# Altium schematic sheet Sheet1.SchDoc
size 359 x 279 mm; SheetNumber: 1; SheetTotal: 1
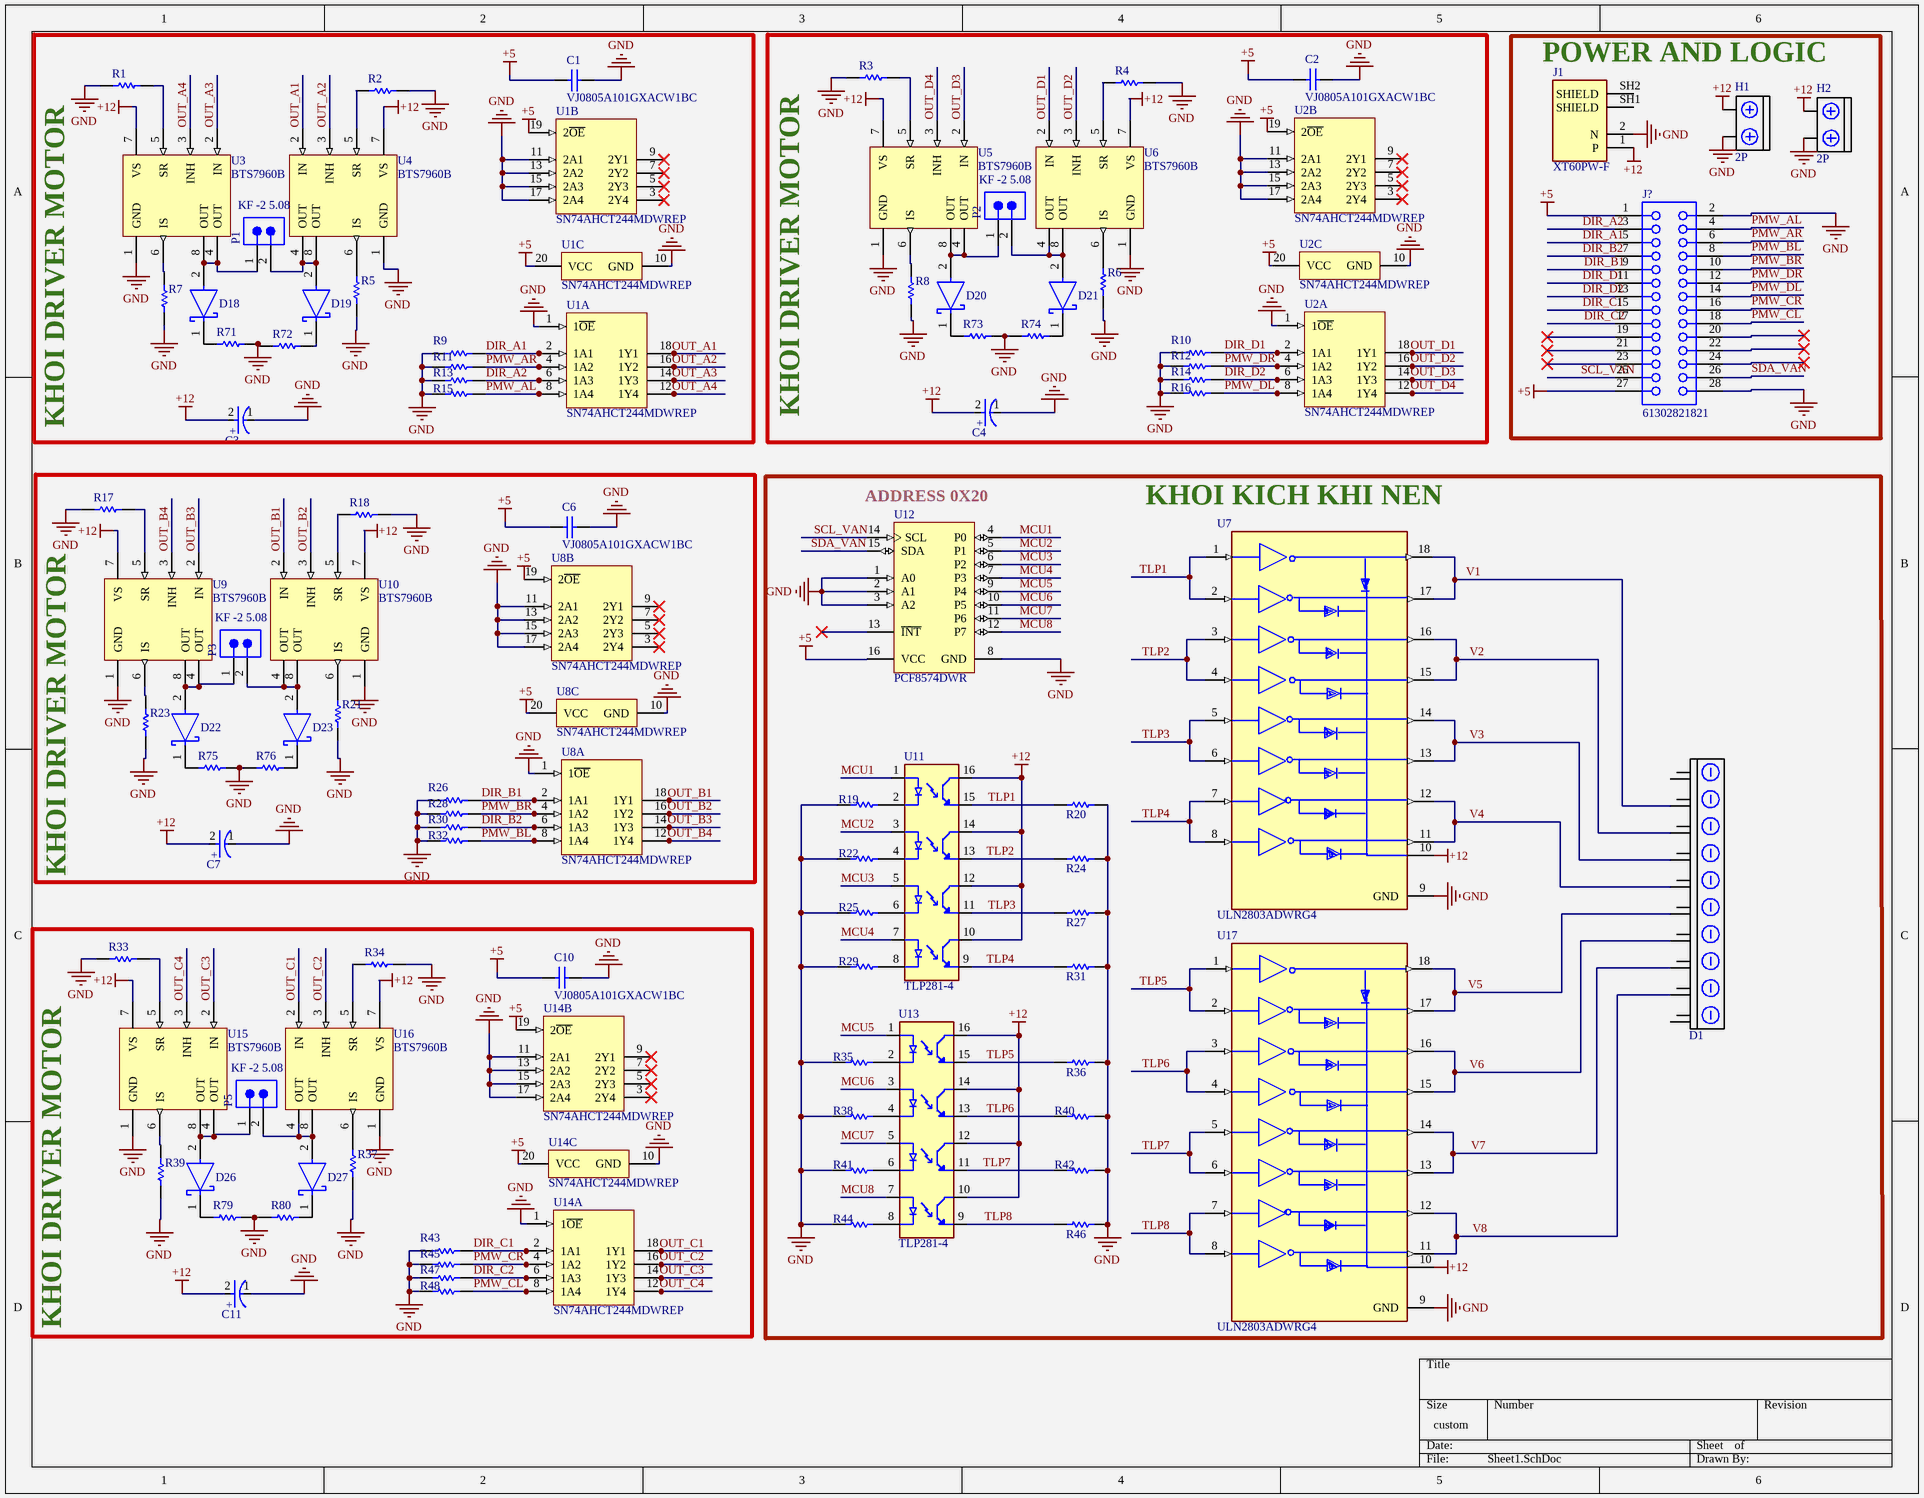
[diagram p0: Sheet1.SchDoc]

## Parts
C1  VJ0805A101GXACW1BC  [CAPC2013X145X50NL20T20]
C2  VJ0805A101GXACW1BC  [CAPC2013X145X50NL20T20]
C3  EEUFM1H151B  [FP-RAD-TH-D_10_0_5-L_12_5-MFG]  (value not drawn)
C4  EEUFM1H151B  [FP-RAD-TH-D_10_0_5-L_12_5-MFG]  (value not drawn)
C6  VJ0805A101GXACW1BC  [CAPC2013X145X50NL20T20]
C7  EEUFM1H151B  [FP-RAD-TH-D_10_0_5-L_12_5-MFG]  (value not drawn)
C10  VJ0805A101GXACW1BC  [CAPC2013X145X50NL20T20]
C11  EEUFM1H151B  [FP-RAD-TH-D_10_0_5-L_12_5-MFG]  (value not drawn)
D1  10P  [KF141_10P]  (value not drawn)
D18  1N5819HW-7-F  [FP-SOD123-IPC_A]  (value not drawn)
D19  1N5819HW-7-F  [FP-SOD123-IPC_A]  (value not drawn)
D20  1N5819HW-7-F  [FP-SOD123-IPC_A]  (value not drawn)
D21  1N5819HW-7-F  [FP-SOD123-IPC_A]  (value not drawn)
D22  1N5819HW-7-F  [FP-SOD123-IPC_A]  (value not drawn)
D23  1N5819HW-7-F  [FP-SOD123-IPC_A]  (value not drawn)
D26  1N5819HW-7-F  [FP-SOD123-IPC_A]  (value not drawn)
D27  1N5819HW-7-F  [FP-SOD123-IPC_A]  (value not drawn)
H1  2P  [KF128-2P]
H2  2P  [KF128-2P]
J1  XT60PW-F  [AMASS_XT60PW-F]
J?  61302821821  [61302821821]
P1  KF -2 5.08  [691312510002]
P2  KF -2 5.08  [691312510002]
P3  KF -2 5.08  [691312510002]
P5  KF -2 5.08  [691312510002]
R1  CRCW08051K00FKTC  [RESC2013X50X30ML20T20]  (value not drawn)
R2  CRCW08051K00FKTC  [RESC2013X50X30ML20T20]  (value not drawn)
R3  CRCW08051K00FKTC  [RESC2013X50X30ML20T20]  (value not drawn)
R4  CRCW08051K00FKTC  [RESC2013X50X30ML20T20]  (value not drawn)
R5  CRCW08051K00FKTC  [RESC2013X50X30ML20T20]  (value not drawn)
R6  CRCW08051K00FKTC  [RESC2013X50X30ML20T20]  (value not drawn)
R7  CRCW08051K00FKTC  [RESC2013X50X30ML20T20]  (value not drawn)
R8  CRCW08051K00FKTC  [RESC2013X50X30ML20T20]  (value not drawn)
R9  CRCW08051K00FKTC  [RESC2013X50X30ML20T20]  (value not drawn)
R10  CRCW08051K00FKTC  [RESC2013X50X30ML20T20]  (value not drawn)
R11  CRCW08051K00FKTC  [RESC2013X50X30ML20T20]  (value not drawn)
R12  CRCW08051K00FKTC  [RESC2013X50X30ML20T20]  (value not drawn)
R13  CRCW08051K00FKTC  [RESC2013X50X30ML20T20]  (value not drawn)
R14  CRCW08051K00FKTC  [RESC2013X50X30ML20T20]  (value not drawn)
R15  CRCW08051K00FKTC  [RESC2013X50X30ML20T20]  (value not drawn)
R16  CRCW08051K00FKTC  [RESC2013X50X30ML20T20]  (value not drawn)
R17  CRCW08051K00FKTC  [RESC2013X50X30ML20T20]  (value not drawn)
R18  CRCW08051K00FKTC  [RESC2013X50X30ML20T20]  (value not drawn)
R19  CRCW08051K00FKTC  [RESC2013X50X30ML20T20]  (value not drawn)
R20  CRCW08051K00FKTC  [RESC2013X50X30ML20T20]  (value not drawn)
R21  CRCW08051K00FKTC  [RESC2013X50X30ML20T20]  (value not drawn)
R22  CRCW08051K00FKTC  [RESC2013X50X30ML20T20]  (value not drawn)
R23  CRCW08051K00FKTC  [RESC2013X50X30ML20T20]  (value not drawn)
R24  CRCW08051K00FKTC  [RESC2013X50X30ML20T20]  (value not drawn)
R25  CRCW08051K00FKTC  [RESC2013X50X30ML20T20]  (value not drawn)
R26  CRCW08051K00FKTC  [RESC2013X50X30ML20T20]  (value not drawn)
R27  CRCW08051K00FKTC  [RESC2013X50X30ML20T20]  (value not drawn)
R28  CRCW08051K00FKTC  [RESC2013X50X30ML20T20]  (value not drawn)
R29  CRCW08051K00FKTC  [RESC2013X50X30ML20T20]  (value not drawn)
R30  CRCW08051K00FKTC  [RESC2013X50X30ML20T20]  (value not drawn)
R31  CRCW08051K00FKTC  [RESC2013X50X30ML20T20]  (value not drawn)
R32  CRCW08051K00FKTC  [RESC2013X50X30ML20T20]  (value not drawn)
R33  CRCW08051K00FKTC  [RESC2013X50X30ML20T20]  (value not drawn)
R34  CRCW08051K00FKTC  [RESC2013X50X30ML20T20]  (value not drawn)
R35  CRCW08051K00FKTC  [RESC2013X50X30ML20T20]  (value not drawn)
R36  CRCW08051K00FKTC  [RESC2013X50X30ML20T20]  (value not drawn)
R37  CRCW08051K00FKTC  [RESC2013X50X30ML20T20]  (value not drawn)
R38  CRCW08051K00FKTC  [RESC2013X50X30ML20T20]  (value not drawn)
R39  CRCW08051K00FKTC  [RESC2013X50X30ML20T20]  (value not drawn)
R40  CRCW08051K00FKTC  [RESC2013X50X30ML20T20]  (value not drawn)
R41  CRCW08051K00FKTC  [RESC2013X50X30ML20T20]  (value not drawn)
R42  CRCW08051K00FKTC  [RESC2013X50X30ML20T20]  (value not drawn)
R43  CRCW08051K00FKTC  [RESC2013X50X30ML20T20]  (value not drawn)
R44  CRCW08051K00FKTC  [RESC2013X50X30ML20T20]  (value not drawn)
R45  CRCW08051K00FKTC  [RESC2013X50X30ML20T20]  (value not drawn)
R46  CRCW08051K00FKTC  [RESC2013X50X30ML20T20]  (value not drawn)
R47  CRCW08051K00FKTC  [RESC2013X50X30ML20T20]  (value not drawn)
R48  CRCW08051K00FKTC  [RESC2013X50X30ML20T20]  (value not drawn)
R71  CRCW08051K00FKTC  [RESC2013X50X30ML20T20]  (value not drawn)
R72  CRCW08051K00FKTC  [RESC2013X50X30ML20T20]  (value not drawn)
R73  CRCW08051K00FKTC  [RESC2013X50X30ML20T20]  (value not drawn)
R74  CRCW08051K00FKTC  [RESC2013X50X30ML20T20]  (value not drawn)
R75  CRCW08051K00FKTC  [RESC2013X50X30ML20T20]  (value not drawn)
R76  CRCW08051K00FKTC  [RESC2013X50X30ML20T20]  (value not drawn)
R79  CRCW08051K00FKTC  [RESC2013X50X30ML20T20]  (value not drawn)
R80  CRCW08051K00FKTC  [RESC2013X50X30ML20T20]  (value not drawn)
U1  SN74AHCT244MDWREP  [DW0020A_N]  (parts A,B,C of 3)
U2  SN74AHCT244MDWREP  [DW0020A_N]  (parts A,B,C of 3)
U3  BTS7960B  [INF-P-TO-263-7-6_M]
U4  BTS7960B  [INF-P-TO-263-7-6_M]
U5  BTS7960B  [INF-P-TO-263-7-6_M]
U6  BTS7960B  [INF-P-TO-263-7-6_M]
U7  ULN2803ADWRG4  [FP-DW0018A-MFG]
U8  SN74AHCT244MDWREP  [DW0020A_N]  (parts A,B,C of 3)
U9  BTS7960B  [INF-P-TO-263-7-6_M]
U10  BTS7960B  [INF-P-TO-263-7-6_M]
U11  TLP281-4  [SOIC127P700X210-16N]
U12  PCF8574DWR  [DW0016A_L]
U13  TLP281-4  [SOIC127P700X210-16N]
U14  SN74AHCT244MDWREP  [DW0020A_N]  (parts A,B,C of 3)
U15  BTS7960B  [INF-P-TO-263-7-6_M]
U16  BTS7960B  [INF-P-TO-263-7-6_M]
U17  ULN2803ADWRG4  [FP-DW0018A-MFG]

## Blocks framed on the sheet
KHOI DRIVER MOTOR: C1 C3 D18 D19 P1 R1 R2 R5 R7 R9 R11 R13 R15 R71 R72 U1 U3 U4
KHOI DRIVER MOTOR: C2 C4 D20 D21 P2 R3 R4 R6 R8 R10 R12 R14 R16 R73 R74 U2 U5 U6
POWER AND LOGIC: H1 H2 J1 J?
KHOI DRIVER MOTOR: C6 C7 D22 D23 P3 R17 R18 R21 R23 R26 R28 R30 R32 R75 R76 U8-U10
KHOI KICH KHI NEN: D1 R19 R20 R22 R24 R25 R27 R29 R31 R35 R36 R38 R40-R42 R44 R46 U7 U11-U13 U17
KHOI DRIVER MOTOR: C10 C11 D26 D27 P5 R33 R34 R37 R39 R43 R45 R47 R48 R79 R80 U14-U16

## Nets
+5: C1.1 C2.1 C6.1 C10.1 J?.1 J?.27 U1.19(2~{OE}) U1.20(VCC) U2.19(2~{OE}) U2.20(VCC) U8.19(2~{OE}) U8.20(VCC) U12.16(VCC) U14.19(2~{OE}) U14.20(VCC)
+12: C3.2(A) C4.2(A) C7.2(A) C11.2(A) H1.1 H2.1 J1.1(P) U3.7(VS) U4.7(VS) U5.7(VS) U6.7(VS) U7.10(COM) U9.7(VS) U10.7(VS) U11.10(CT4) U11.12(CT3) U11.14(CT2) U11.16(CT1) U13.10(CT4) U13.12(CT3) U13.14(CT2) U13.16(CT1) U15.7(VS) U16.7(VS) U17.10(COM)
GND: C1.2 C2.2 C3.1(C) C4.1(C) C6.2 C7.1(C) C10.2 C11.1(C) H1.2 H2.2 J1.2(N) J?.2 J?.28 R1.2 R2.2 R3.2 R4.2 R5.1 R6.1 R7.1 R8.1 R9.1 R10.1 R11.1 R12.1 R13.1 R14.1 R15.1 R16.1 R17.2 R18.2 R19.1 R20.1 R21.1 R22.1 R23.1 R24.1 R25.1 R26.1 R27.1 R28.1 R29.1 R30.1 R31.1 R32.1 R33.2 R34.2 R35.1 R36.1 R37.1 R38.1 R39.1 R40.2 R41.1 R42.2 R43.1 R44.1 R45.1 R46.1 R47.1 R48.1 R71.1 R72.2 R73.1 R74.2 R75.1 R76.2 R79.1 R80.2 U1.1(1~{OE}) U1.10(GND) U1.11(2A1) U1.13(2A2) U1.15(2A3) U1.17(2A4) U2.1(1~{OE}) U2.10(GND) U2.11(2A1) U2.13(2A2) U2.15(2A3) U2.17(2A4) U3.1(GND) U4.1(GND) U5.1(GND) U6.1(GND) U7.9(GND) U8.1(1~{OE}) U8.10(GND) U8.11(2A1) U8.13(2A2) U8.15(2A3) U8.17(2A4) U9.1(GND) U10.1(GND) U12.1(A0) U12.2(A1) U12.3(A2) U12.8(GND) U14.1(1~{OE}) U14.10(GND) U14.11(2A1) U14.13(2A2) U14.15(2A3) U14.17(2A4) U15.1(GND) U16.1(GND) U17.9(GND)
DIR_A1: J?.5 R9.2 U1.2(1A1)
DIR_A2: J?.3 R13.2 U1.6(1A3)
DIR_B1: J?.9 R26.2 U8.2(1A1)
DIR_B2: J?.7 R30.2 U8.6(1A3)
DIR_C1: J?.15 R43.2 U14.2(1A1)
DIR_C2: J?.17 R47.2 U14.6(1A3)
DIR_D1: J?.11 R10.2 U2.2(1A1)
DIR_D2: J?.13 R14.2 U2.6(1A3)
MCU1: U11.1(A1) U12.4(P0)
MCU2: U11.3(A2) U12.5(P1)
MCU3: U11.5(A3) U12.6(P2)
MCU4: U11.7(A4) U12.7(P3)
MCU5: U12.9(P4) U13.1(A1)
MCU6: U12.10(P5) U13.3(A2)
MCU7: U12.11(P6) U13.5(A3)
MCU8: U12.12(P7) U13.7(A4)
OUT_A1: U1.18(1Y1) U4.2(IN)
OUT_A2: U1.16(1Y2) U4.3(INH)
OUT_A3: U1.14(1Y3) U3.2(IN)
OUT_A4: U1.12(1Y4) U3.3(INH)
OUT_B1: U8.18(1Y1) U10.2(IN)
OUT_B2: U8.16(1Y2) U10.3(INH)
OUT_B3: U8.14(1Y3) U9.2(IN)
OUT_B4: U8.12(1Y4) U9.3(INH)
OUT_C1: U14.18(1Y1) U16.2(IN)
OUT_C2: U14.16(1Y2) U16.3(INH)
OUT_C3: U14.14(1Y3) U15.2(IN)
OUT_C4: U14.12(1Y4) U15.3(INH)
OUT_D1: U2.18(1Y1) U6.2(IN)
OUT_D2: U2.16(1Y2) U6.3(INH)
OUT_D3: U2.14(1Y3) U5.2(IN)
OUT_D4: U2.12(1Y4) U5.3(INH)
PMW_AL: J?.4 R15.2 U1.8(1A4)
PMW_AR: J?.6 R11.2 U1.4(1A2)
PMW_BL: J?.8 R32.2 U8.8(1A4)
PMW_BR: J?.10 R28.2 U8.4(1A2)
PMW_CL: J?.18 R48.2 U14.8(1A4)
PMW_CR: J?.16 R45.2 U14.4(1A2)
PMW_DL: J?.14 R16.2 U2.8(1A4)
PMW_DR: J?.12 R12.2 U2.4(1A2)
SCL_VAN: J?.25 U12.14(SCL)
SDA_VAN: J?.26 U12.15(SDA)
TLP1: R20.2 U7.1(1B) U7.2(2B) U11.15(ET1)
TLP2: R24.2 U7.3(3B) U7.4(4B) U11.13(ET2)
TLP3: R27.2 U7.5(5B) U7.6(6B) U11.11(ET3)
TLP4: R31.2 U7.7(7B) U7.8(8B) U11.9(ET4)
TLP5: R36.2 U13.15(ET1) U17.1(1B) U17.2(2B)
TLP6: R40.1 U13.13(ET2) U17.3(3B) U17.4(4B)
TLP7: R42.1 U13.11(ET3) U17.5(5B) U17.6(6B)
TLP8: R46.2 U13.9(ET4) U17.7(7B) U17.8(8B)
V1: D1.12 U7.17(2C) U7.18(1C)
V2: D1.13 U7.15(4C) U7.16(3C)
V3: D1.14 U7.13(6C) U7.14(5C)
V4: D1.15 U7.11(8C) U7.12(7C)
V5: D1.16 U17.17(2C) U17.18(1C)
V6: D1.17 U17.15(4C) U17.16(3C)
V7: D1.18 U17.13(6C) U17.14(5C)
V8: D1.19 U17.11(8C) U17.12(7C)
NetD18_1: D18.1(C) R71.2
NetD18_2: D18.2(A) P1.1 U3.4(OUT) U3.8(OUT)
NetD19_1: D19.1(C) R72.1
NetD19_2: D19.2(A) P1.2 U4.4(OUT) U4.8(OUT)
NetD20_1: D20.1(C) R73.2
NetD20_2: D20.2(A) P2.1 U5.4(OUT) U5.8(OUT)
NetD21_1: D21.1(C) R74.1
NetD21_2: D21.2(A) P2.2 U6.4(OUT) U6.8(OUT)
NetD22_1: D22.1(C) R75.2
NetD22_2: D22.2(A) P3.1 U9.4(OUT) U9.8(OUT)
NetD23_1: D23.1(C) R76.1
NetD23_2: D23.2(A) P3.2 U10.4(OUT) U10.8(OUT)
NetD26_1: D26.1(C) R79.2
NetD26_2: D26.2(A) P5.1 U15.4(OUT) U15.8(OUT)
NetD27_1: D27.1(C) R80.1
NetD27_2: D27.2(A) P5.2 U16.4(OUT) U16.8(OUT)
NetR1_1: R1.1 U3.5(SR)
NetR2_1: R2.1 U4.5(SR)
NetR3_1: R3.1 U5.5(SR)
NetR4_1: R4.1 U6.5(SR)
NetR5_2: R5.2 U4.6(IS)
NetR6_2: R6.2 U6.6(IS)
NetR7_2: R7.2 U3.6(IS)
NetR8_2: R8.2 U5.6(IS)
NetR17_1: R17.1 U9.5(SR)
NetR18_1: R18.1 U10.5(SR)
NetR19_2: R19.2 U11.2(C1)
NetR21_2: R21.2 U10.6(IS)
NetR22_2: R22.2 U11.4(C2)
NetR23_2: R23.2 U9.6(IS)
NetR25_2: R25.2 U11.6(C3)
NetR29_2: R29.2 U11.8(C4)
NetR33_1: R33.1 U15.5(SR)
NetR34_1: R34.1 U16.5(SR)
NetR35_2: R35.2 U13.2(C1)
NetR37_2: R37.2 U16.6(IS)
NetR38_2: R38.2 U13.4(C2)
NetR39_2: R39.2 U15.6(IS)
NetR41_2: R41.2 U13.6(C3)
NetR44_2: R44.2 U13.8(C4)

Not connected (* = marked no-connect by the designer): D1 1 2 3 4 5 6 7 8 9 10 11 20; J1 SH1(SHIELD) SH2(SHIELD); J? 19* 20* 21* 22* 23* 24*; U1 3(2Y4)* 5(2Y3)* 7(2Y2)* 9(2Y1)*; U2 3(2Y4)* 5(2Y3)* 7(2Y2)* 9(2Y1)*; U8 3(2Y4)* 5(2Y3)* 7(2Y2)* 9(2Y1)*; U12 13(~{INT})*; U14 3(2Y4)* 5(2Y3)* 7(2Y2)* 9(2Y1)*

## Notes on the sheet
- (near U12) ADDRESS 0X20
- (in symbol CMP-05427-001971-1) +

## Library data of the parts
C1 C2 C6 C10 = CMP-2007-01634-1: Manufacturer: Vitramon; Part Number: VJ0805A101GXACW1BC
C3 C4 C7 C11 = CMP-05427-001971-1: Aluminum Electrolytic Capacitors (Radial Lead Type) 150uF ±20% 50V; Impedance: 42mR; Life (Hours): 4000Hour; Lead Diameter: 0.6mm; Ripple Current: 1.17A; Polarity: Polar; Dissipation Factor: 0.1%; Lead Pitch: 5mm; Height: 12.5mm; Length: 12.5mm; Package Quantity: 500; Max Operating Temperature: 105°C; Contact Plating: Tin; Height - Seated (Max): 0.551inch; Packaging: Ammo Pack; Lead Free: Lead Free; RoHS Compliant: Yes; Series: FM; Diameter: 10mm; Case/Package: Radial; Capacitance: 150uF; Min Operating Temperature: -40°C; Voltage Rating: 50V; Termination: Radial; Radiation Hardening: No; Mount: Through Hole; Tolerance: 20%; Voltage Rating (DC): 50V; ESR (Equivalent Series Resistance): 42mR
D1 = KF141_10p: DOMINO 5.08MM
D18-D23 D26 D27 = CMP-0303-00003-3: DIODE SCHOTTKY 40V 1A SOD123; Forward Voltage: 450mV; Capacitance: 110pF; Max Forward Surge Current (Ifsm): 25A; Peak Reverse Current: 50uA; Polarity: Standard; Element Configuration: Single; Max Power Dissipation: 450mW; Min Operating Temperature: -65°C; Package Quantity: 3000; Contact Plating: Tin; Weight: 0.000353oz; Max Repetitive Reverse Voltage (Vrrm): 40V; Max Reverse Voltage (DC): 40V; Height: 1.25mm; Average Rectified Current: 1A; Width: 1.7mm; Case/Package: SOD-123-2; Lead Free: Lead Free; Max Operating Temperature: 125°C; Current Rating: 1A; Termination: SMD/SMT; Forward Current: 1A; Radiation Hardening: No; Number of Pins: 2; Length: 2.85mm; Voltage Rating (DC): 40V; REACH SVHC: No SVHC; Peak Non-Repetitive Surge Current: 25A; Packaging: Tape and Reel; Output Current: 1A
H1 H2 = KF-128-2P: DOMINO 5.08MM
J1 = XT60PW-F: Connector: DC supply; socket; female; XT60; 30A; 500V; PIN: 2; THT; MF: AMASS; SnapEDA_Link: https://www.snapeda.com/parts/XT60PW-F/AMASS/view-part/?ref=snap; Package: Package; Value: *; MP: XT60PW-F; Check_prices: https://www.snapeda.com/parts/XT60PW-F/AMASS/view-part/?ref=eda
J? = CMP-1502-01360-4: Btb Conn, Rcpt, 28Pos, 2Row, 2.54Mm Rohs Compliant: Yes; Current Rating: 3A; Contact Resistance: 20mΩ; Operating Supply Voltage: 250V; Gender: Female; Orientation: Vertical; Lead Pitch: 2.54mm; Number of Pins: 28; RoHS: Non-Compliant
P1-P3 P5 = CMP-1502-02169-3: 312; 5.08MM Pitch Straight Pluggable Term Block, Pcb Header, Through Hole, 2 Way; Voltage: 300V; Current: 20A; Number of Levels: 1; Gender: Male; Number of Contacts: 2; Lead Pitch: 5.08mm; Height: 12mm; Width: 10.16mm; Number of Rows: 1; Number of Pins: 2; Contact Plating: Tin; Length: 11.5mm; Termination: Solder; Contact Material: Brass; Packaging: Box; Mount: Through Hole; Pitch: 5.08mm; RoHS: Compliant; Color: Green; Number of Positions Per Level: 2
R1-R48 R71-R76 R79 R80 = CMP-2001-04268-1: Manufacturer: Vishay Dale; Part Number: CRCW08051K00FKTC
U1 U2 U8 U14 = CMP-0440-00672-3: Enhanced Product Octal Buffers/Drivers With 3-State Outputs, DW0020A, LARGE T&R; Generic Part Number: SN74AHCT244-EP; Manufacturer: Texas Instruments; Voltage(Nom)(V): 5; Output Type: CMOS; VCC(Max)(V): 5.5; ICC @ Nom Voltage(Max)(mA): 0.04; VCC(Min)(V): 4.5; Input Type: TTL; tpd @ Nom Voltage(Max)(ns): 9.5; F @ Nom Voltage(Max)(Mhz): 110; Rating: HiRel Enhanced Product; PackageVersion: http://www.ti.com/lit/ml/mpds173a/mpds173a.pdf; DatasheetVersion: SCLS493A; PackageReference: DW0020A; Operating Temperature Range(C): -55 to 125; Code_JEDEC: MS-013
U3-U6 U9 U10 U15 U16 = CMP-1114-00025-1: High Current PN Half Bridge NovalithIC, -40 to 150 degC, P-TO-263-7-6; Manufacturer: Infineon; Iq (typ): 7 uA; Green: FALSE; ComponentLink1Description: Manufacturer URL; Halogen-free: FALSE; PackageDescription: 7-Pin Plastic Transistor Single Outline Package, 9.9 x 9.2 mm Body, 1.27 mm Pitch; ComponentLink2Description: Datasheet; ComponentLink3Description: Package Specification; ComponentLink1URL: http://www.infineon.com/; ComponentLink2URL: http://www.infineon.com/dgdl/BTS7960_Datasheet.pdf?folderId=db3a304412b407950112b408e8c90004&fileId=db3a304412b407950112b43945006d5d&location=en.Products.Automotive_ICs.Motor_Drivers__Automotive_.Integrated_High_Current_Motor_Drivers__NovalithIC____Trilith; ComponentLink3URL: http://www.infineon.com/dgdl/BTS7970B_Datasheet.pdf?folderId=db3a304412b407950112b408e8c90004&fileId=db3a304412b407950112b43949b36d61&sId=db3a30433d68e984013d7db637dc5e6a; PackageReference: P-TO-263-7-6; PackageVersion: May-06; Mounting Technology: Surface Mount; RevisionNote: Re-Activated Devices; PartNumber: BTS7960B; DatasheetVersion: Rev. 1.1
U7 U17 = CMP-04912-000023-1: TRANS 8NPN DARL 50V 0.5A 18SO; Manufacturer: Texas Instruments; Number Of Drivers: 8; Max Junction Temp: +150°C; Standoff Height: 0.1mm; Turn On Delay Time: 20ns; Nominal Supply Current: 0.93mA; Turn Off Delay Time: 130ns; Output Current: 500mA; Manufacturer Part Number: ULN2803ADWRG4; Mouser Description: Darlington Transistors TRANSISTOR ARRAYS; Temperature Range High: +85°C; Ipc Land Pattern Name: SOIC127P1030X265-18; RoHS: TRUE; ComponentLink2URL: http://www.ti.com/lit/ds/symlink/uln2803a.pdf; Device Class L2: Power Management ICs; Output Voltage: 50V; Digikey Description: TRANS 8NPN DARL 50V 0.5A 18SO; Package: DW0018A; Device Class L3: Gate Drivers; Octopart: https://octopart.com/uln2803adwrg4-texas+instruments-2343640; ComponentLink2Description: Datasheet; Ambient Temperature Range High: +85°C; Lead Free: Yes; Device Class L1: Integrated Circuits (ICs); Height: 2.65mm; Category: IC; Automotive: No; Temperature: -40°C to +85°C; Temperature Range Low: -40°C; Ambient Temperature Range Low: -40°C; Number Of Outputs: 8
U11 U13 = TLP281-4: Optoisolator Transistor Output 2500Vrms 4 Channel 16-SOP; MF: Toshiba Semiconductor; SnapEDA_Link: https://www.snapeda.com/parts/TLP281-4/Toshiba/view-part/?ref=snap; Package: SOP-16 Toshiba; Value: *; MP: TLP281-4; Check_prices: https://www.snapeda.com/parts/TLP281-4/Toshiba/view-part/?ref=eda
U12 = CMP-0314-00117-2: Remote 8-Bit I/O Expander for I2C-Bus, 2.5 to 6 V, -40 to 85 degC, 16-pin SOIC (DW), Green (RoHS & no Sb/Br); Manufacturer: Texas Instruments; Voltage Nodes(V): 5, 3.3; I2C Address: 0100 xxx; VCC(Min)(V): 2.5; Max Frequency(kHz): 100; Interrupt Output: Yes; fSCLK(Max)(MHz): 0.1; VCC(Max)(V): 6; SubFamily: I2C IO Expander; # of I/Os: 8; Vcc range(V): 2.5 to 6.0; ComponentLink1Description: Datasheet; ComponentLink2URL: http://www.ti.com/litv/pdf/msoi003g; PackageReference: DW0016A; DatasheetVersion: SCPS068G; Code_JEDEC: MS-013-AA; PackageVersion: revG, Jan-2011; Push-Pull I/O Type: Yes; ComponentLink1URL: http://www.ti.com/general/docs/lit/getliterature.tsp?genericPartNumber=PCF8574&fileType=pdf; Reset Input: No; ComponentLink2Description: Package Specification; Eco-Plan: Green (RoHS & no Sb/Br); PackageDescription: 16-Pin Small Outline Integrated Circuit, 10.3 x 7.5 mm, Pitch 1.27 mm Pitch; Mounting Technology: Surface Mount; PartNumber: PCF8574DWR